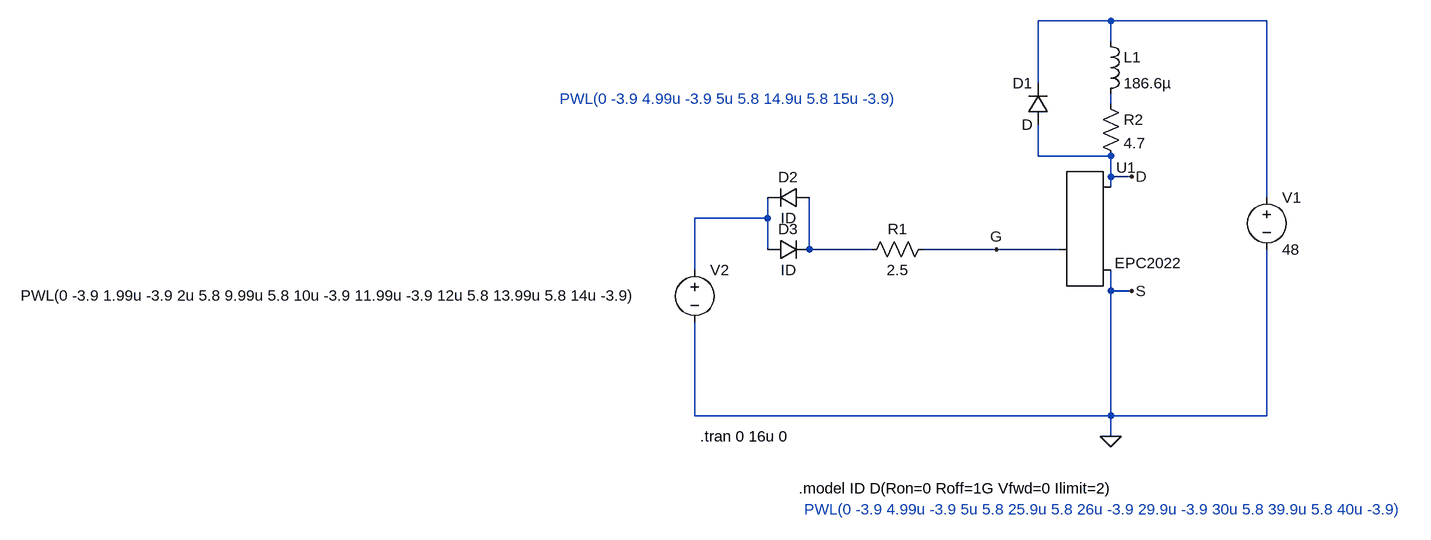
[diagram p0: schematic DPT_EPC2022.asc]
DPT_EPC2022.asc, the LTspice schematic file:
Version 4
SHEET 1 880 680
WIRE -48 -176 -160 -176
WIRE 192 -176 -48 -176
WIRE -48 -144 -48 -176
WIRE -160 -80 -160 -176
WIRE -48 -48 -48 -64
WIRE -160 32 -160 -16
WIRE -48 32 -160 32
WIRE -48 64 -48 32
WIRE -16 64 -48 64
WIRE -48 80 -48 64
WIRE 192 96 192 -176
WIRE -576 128 -576 96
WIRE -576 128 -688 128
WIRE -576 176 -576 128
WIRE -512 176 -512 96
WIRE -416 176 -512 176
WIRE -224 176 -336 176
WIRE -128 176 -224 176
WIRE -688 208 -688 128
WIRE -48 240 -48 208
WIRE -16 240 -48 240
WIRE -688 432 -688 288
WIRE -48 432 -48 240
WIRE -48 432 -688 432
WIRE 192 432 192 176
WIRE 192 432 -48 432
WIRE -48 464 -48 432
FLAG -16 240 S
FLAG -16 64 D
FLAG -224 176 G
FLAG -48 464 0
SYMBOL EPCGaN -128 176 R0
WINDOW 3 86 21 Left 2
SYMATTR Value EPC2022
SYMATTR InstName U1
SYMBOL res -64 -64 R0
SYMATTR InstName R2
SYMATTR Value 4.7
SYMBOL diode -144 -16 R180
WINDOW 0 24 64 Left 2
WINDOW 3 24 0 Left 2
SYMATTR InstName D1
SYMBOL voltage 192 80 R0
WINDOW 123 0 0 Left 0
WINDOW 39 0 0 Left 0
SYMATTR InstName V1
SYMATTR Value 48
SYMBOL voltage -688 192 R0
WINDOW 123 0 0 Left 0
WINDOW 39 0 0 Left 0
WINDOW 3 -1037 55 Left 2
SYMATTR Value PWL(0 -3.9 1.99u -3.9 2u 5.8 9.99u 5.8 10u -3.9 11.99u -3.9 12u 5.8 13.99u 5.8 14u -3.9)
SYMATTR InstName V2
SYMBOL ind -64 -160 R0
SYMATTR InstName L1
SYMATTR Value 186.6µ
SYMBOL diode -512 80 R90
WINDOW 0 0 32 VBottom 2
WINDOW 3 32 32 VTop 2
SYMATTR InstName D2
SYMATTR Value ID
SYMBOL diode -576 192 R270
WINDOW 0 32 32 VTop 2
WINDOW 3 0 32 VBottom 2
SYMATTR InstName D3
SYMATTR Value ID
SYMBOL res -320 160 R90
WINDOW 0 0 56 VBottom 2
WINDOW 3 32 56 VTop 2
SYMATTR InstName R1
SYMATTR Value 2.5
TEXT -520 576 Left 2 ;PWL(0 -3.9 4.99u -3.9 5u 5.8 25.9u 5.8 26u -3.9 29.9u -3.9 30u 5.8 39.9u 5.8 40u -3.9)
TEXT -896 -56 Left 2 ;PWL(0 -3.9 4.99u -3.9 5u 5.8 14.9u 5.8 15u -3.9)
TEXT -528 544 Left 2 !.model ID D(Ron=0 Roff=1G Vfwd=0 Ilimit=2)
TEXT -680 464 Left 2 !.tran 0 16u 0

The netlist it stands for:
* DPT_EPC2022.asc
XU1 G D 0 EPC2022
R2 N002 D 4.7
D1 D N001 D
V1 N001 0 48
V2 N003 0 PWL(0 -3.9 1.99u -3.9 2u 5.8 9.99u 5.8 10u -3.9 11.99u -3.9 12u 5.8 13.99u 5.8 14u -3.9)
L1 N001 N002 186.6µ
D2 N004 N003 ID
D3 N003 N004 ID
R1 G N004 2.5
.model D D
.lib standard.dio
* PWL(0 -3.9 4.99u -3.9 5u 5.8 25.9u 5.8 26u -3.9 29.9u -3.9 30u 5.8 39.9u 5.8 40u -3.9)
* PWL(0 -3.9 4.99u -3.9 5u 5.8 14.9u 5.8 15u -3.9)
.model ID D(Ron=0 Roff=1G Vfwd=0 Ilimit=2)
.tran 0 16u 0
.backanno
.end